# Altium project Low_Voltage_Cut_Off.PrjPcb
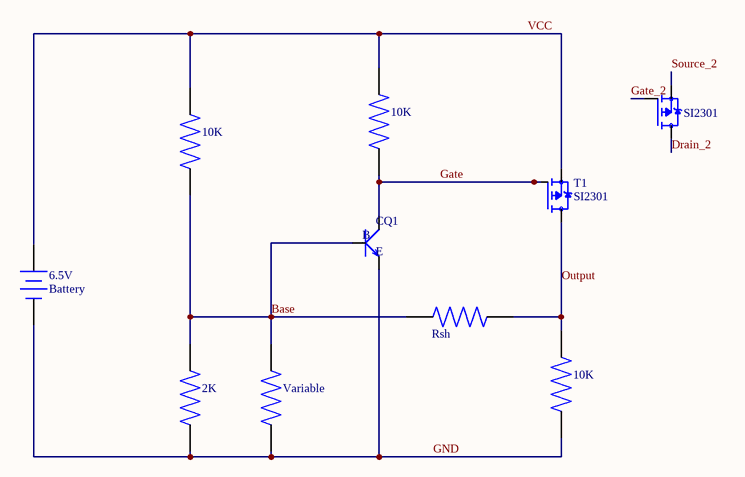
[diagram p0: Sheet1.SchDoc]
1 sheet, 10 parts. Net scope: global (net labels, ports and power ports of the same name join across sheets).
Board file: PCB1.PcbDoc

## Sheet Sheet1.SchDoc
size A4; SheetNumber: 1; SheetTotal: 1

### Parts
6.5V  Battery  [BAT-2]
Q1  SMD-TRANSISTORS-NPN-25V-500MW(SOT-23)  [SOT-23]  (value not drawn)
R1  10K  [RESC3216X75N]
R2  2K  [RESC3216X75N]
R3  Variable  [RESC3216X75N]
R4  10K  [RESC3216X75N]
R5  Rsh  [RESC3216X75N]
R6  10K  [RESC3216X75N]
T1  SI2301  [DESTO_SOT23]
T2  SI2301  [DESTO_SOT23]

### Nets
Base: Q1.1(B) R1.1 R2.2 R3.2 R5.1
Drain_2: T2.3(D)
Gate: Q1.3(C) R4.1 T1.1(G)
Gate_2: T2.1(G)
GND: 6.5V.2(-) Q1.2(E) R2.1 R3.1 R6.1
Output: R5.2 R6.2 T1.3(D)
Source_2: T2.2(S)
VCC: 6.5V.1(+) R1.2 R4.2 T1.2(S)

### Library data of the parts
6.5V = Battery: Multicell Battery; Published: 24-Mar-1999; LatestRevisionDate: 17-Jul-2002; LatestRevisionNote: Re-released for DXP Platform.; PackageReference: BAT-2; Publisher: Altium Limited; PackageDescription: Battery; 2 Leads
Q1 = SMD-TRANSISTORS-NPN-25V-500MW(SOT-23): Bipolar (BJT) Transistor NPN 25 V 500 mA 150MHz 300 mW Surface Mount SOT-23; MF: UMW; MP: S8050; Purchase-URL: https://pricing.snapeda.com/search/part/S8050/?ref=eda; Check_prices: https://www.snapeda.com/parts/S8050/Umwelt+Sensor+Teknik/view-part/?ref=eda; SnapEDA_Link: https://www.snapeda.com/parts/S8050/Umwelt+Sensor+Teknik/view-part/?ref=snap; Price: None; Availability: In Stock; Package: None; Value: *
R1-R6 = CR1206-J/-000ELF: CR1206 SMD Thick Film Resistor,jumper 0R | Bourns CR1206-J/-000ELF; SnapEDA_Link: https://www.snapeda.com/parts/CR1206-J/-000ELF/Bourns/view-part/?ref=snap; Package: 3216 Bourns; Value: *; MF: Bourns; MP: CR1206-J/-000ELF; Check_prices: https://www.snapeda.com/parts/CR1206-J/-000ELF/Bourns/view-part/?ref=eda
T1 T2 = SI2301: MOSFET P-CH 20V 2.2A SOT23-3; MF: Micro Commercial Components (MCC); SnapEDA_Link: https://www.snapeda.com/parts/SI2301/Micro+Commercial+Components/view-part/?ref=snap; Package: SOT-23 MCC; Value: *; MP: SI2301; Check_prices: https://www.snapeda.com/parts/SI2301/Micro+Commercial+Components/view-part/?ref=eda